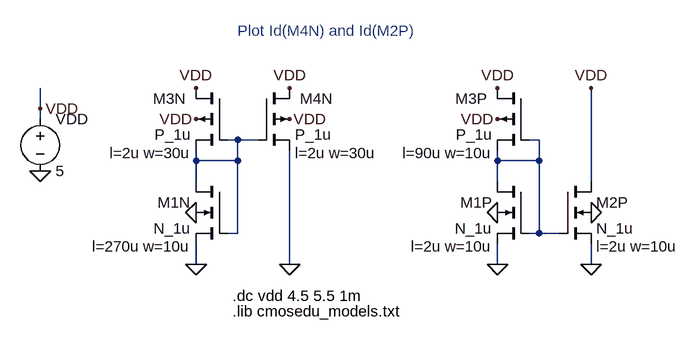
[diagram p0: schematic Fig20_13.asc]
Fig20_13.asc, the LTspice schematic file:
Version 4
SHEET 1 1288 680
WIRE 288 -16 288 -48
WIRE 288 0 288 -16
WIRE 528 64 528 48
WIRE 528 96 528 64
WIRE 528 224 528 192
WIRE 592 32 576 32
WIRE 592 64 528 64
WIRE 592 64 592 32
WIRE 592 176 576 176
WIRE 592 176 592 64
WIRE 624 32 592 32
WIRE 672 224 672 48
WIRE 992 64 992 48
WIRE 992 96 992 64
WIRE 992 224 992 192
WIRE 1056 32 1040 32
WIRE 1056 64 992 64
WIRE 1056 64 1056 32
WIRE 1056 176 1040 176
WIRE 1056 176 1056 64
WIRE 1088 176 1056 176
WIRE 1136 96 1136 -48
WIRE 1136 224 1136 192
FLAG 288 80 0
FLAG 288 -16 VDD
FLAG 528 0 VDD
FLAG 672 0 VDD
FLAG 528 -48 VDD
FLAG 672 -48 VDD
FLAG 528 224 0
FLAG 672 224 0
FLAG 528 144 0
FLAG 992 0 VDD
FLAG 992 -48 VDD
FLAG 992 224 0
FLAG 1136 224 0
FLAG 992 144 0
FLAG 1136 144 0
FLAG 1136 -48 VDD
SYMBOL pmos4 624 -48 R0
WINDOW 0 64 16 Left 0
WINDOW 123 56 100 Left 0
SYMATTR InstName M4N
SYMATTR Value2 l=2u w=30u
SYMATTR Value P_1u
SYMBOL pmos4 576 -48 M0
WINDOW 0 63 16 Left 0
WINDOW 123 56 100 Left 0
SYMATTR InstName M3N
SYMATTR Value2 l=2u w=30u
SYMATTR Value P_1u
SYMBOL voltage 288 -16 R0
SYMATTR InstName VDD
SYMATTR Value 5
SYMBOL nmos4 576 96 M0
WINDOW 123 56 100 Left 0
SYMATTR Value2 l=270u w=10u
SYMATTR InstName M1N
SYMATTR Value N_1u
SYMBOL pmos4 1040 -48 M0
WINDOW 0 63 16 Left 0
WINDOW 123 56 100 Left 0
SYMATTR InstName M3P
SYMATTR Value2 l=90u w=10u
SYMATTR Value P_1u
SYMBOL nmos4 1040 96 M0
WINDOW 123 56 100 Left 0
SYMATTR Value2 l=2u w=10u
SYMATTR InstName M1P
SYMATTR Value N_1u
SYMBOL nmos4 1088 96 R0
WINDOW 123 56 100 Left 0
SYMATTR Value2 l=2u w=10u
SYMATTR InstName M2P
SYMATTR Value N_1u
TEXT 584 296 Left 0 !.lib cmosedu_models.txt
TEXT 592 -136 Left 0 ;Plot Id(M4N) and Id(M2P)
TEXT 584 272 Left 0 !.dc vdd 4.5 5.5 1m

The netlist it stands for:
* Fig20_13.asc
M4N VDD N001 0 VDD P_1u l=2u w=30u
M3N VDD N001 N001 VDD P_1u l=2u w=30u
VDD VDD 0 5
M1N N001 N001 0 0 N_1u l=270u w=10u
M3P VDD N002 N002 VDD P_1u l=90u w=10u
M1P N002 N002 0 0 N_1u l=2u w=10u
M2P VDD N002 0 0 N_1u l=2u w=10u
.model NMOS NMOS
.model PMOS PMOS
.lib standard.mos
.lib cmosedu_models.txt
* Plot Id(M4N) and Id(M2P)
.dc vdd 4.5 5.5 1m
.backanno
.end